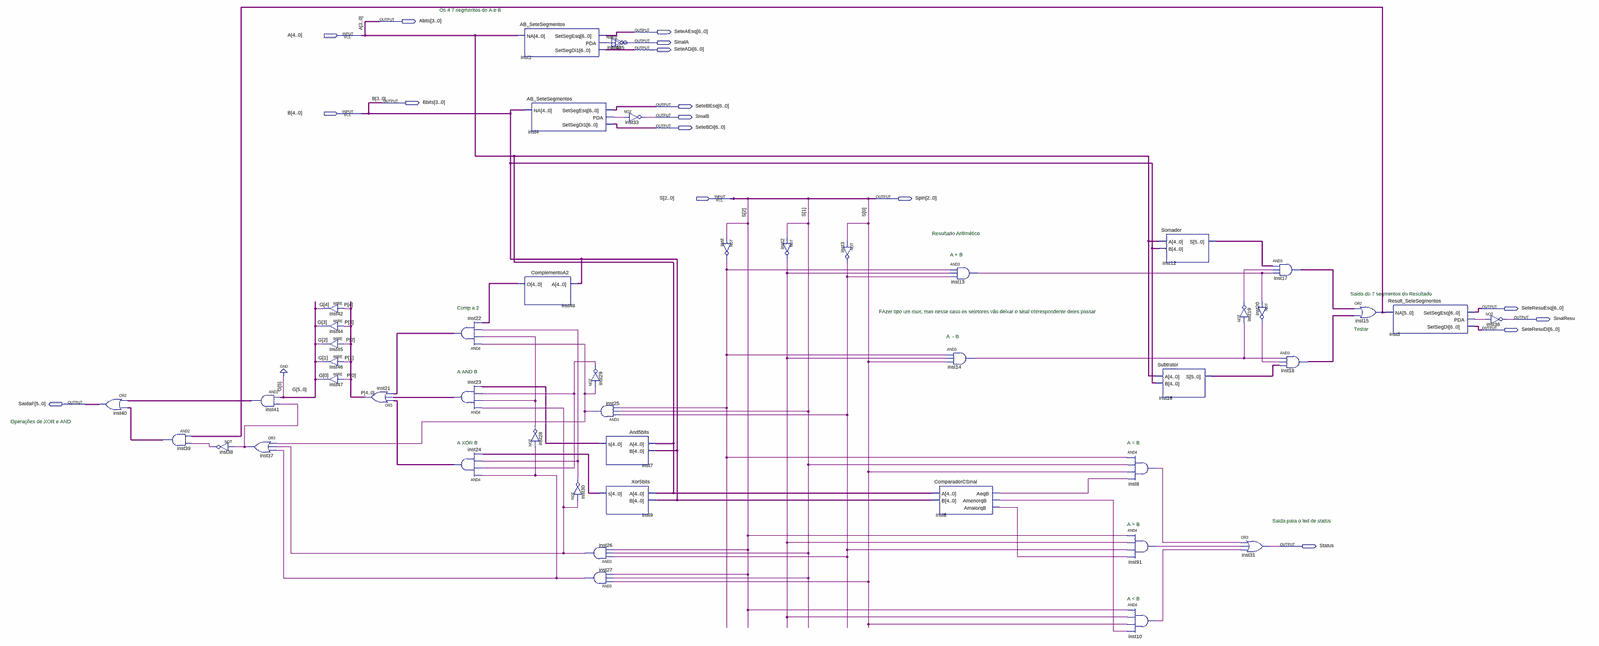
[diagram p0: schematic sheet, whole]
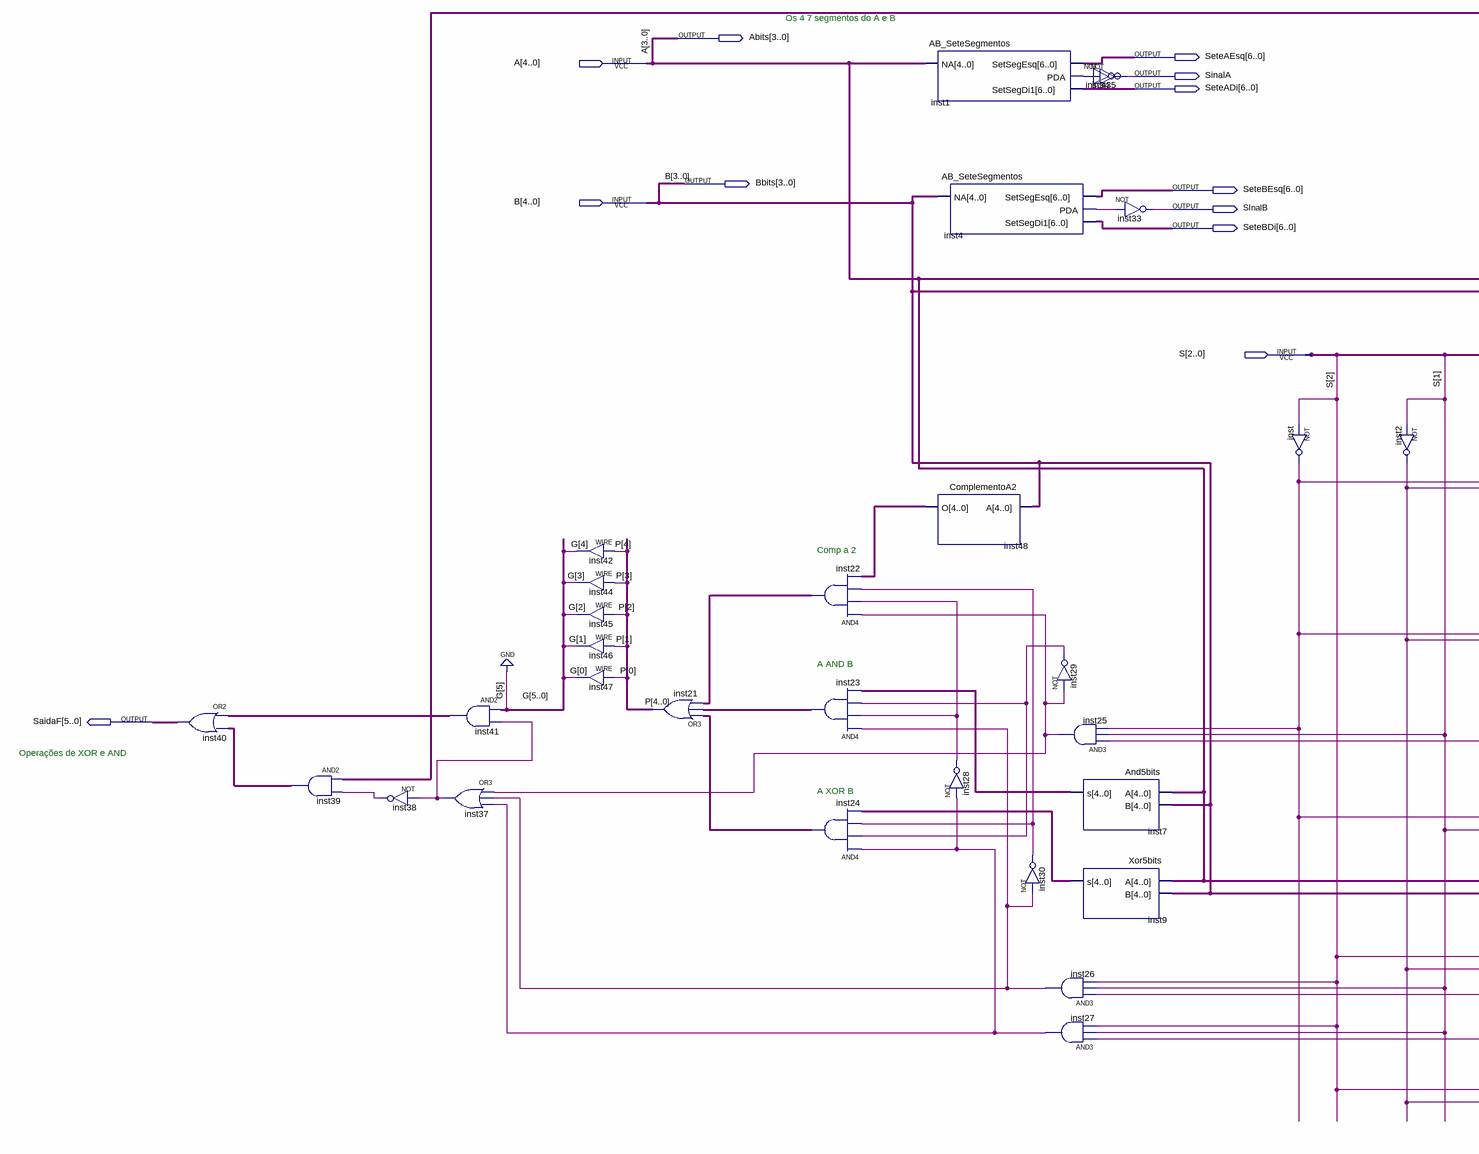
[diagram p1: schematic sheet, left part]
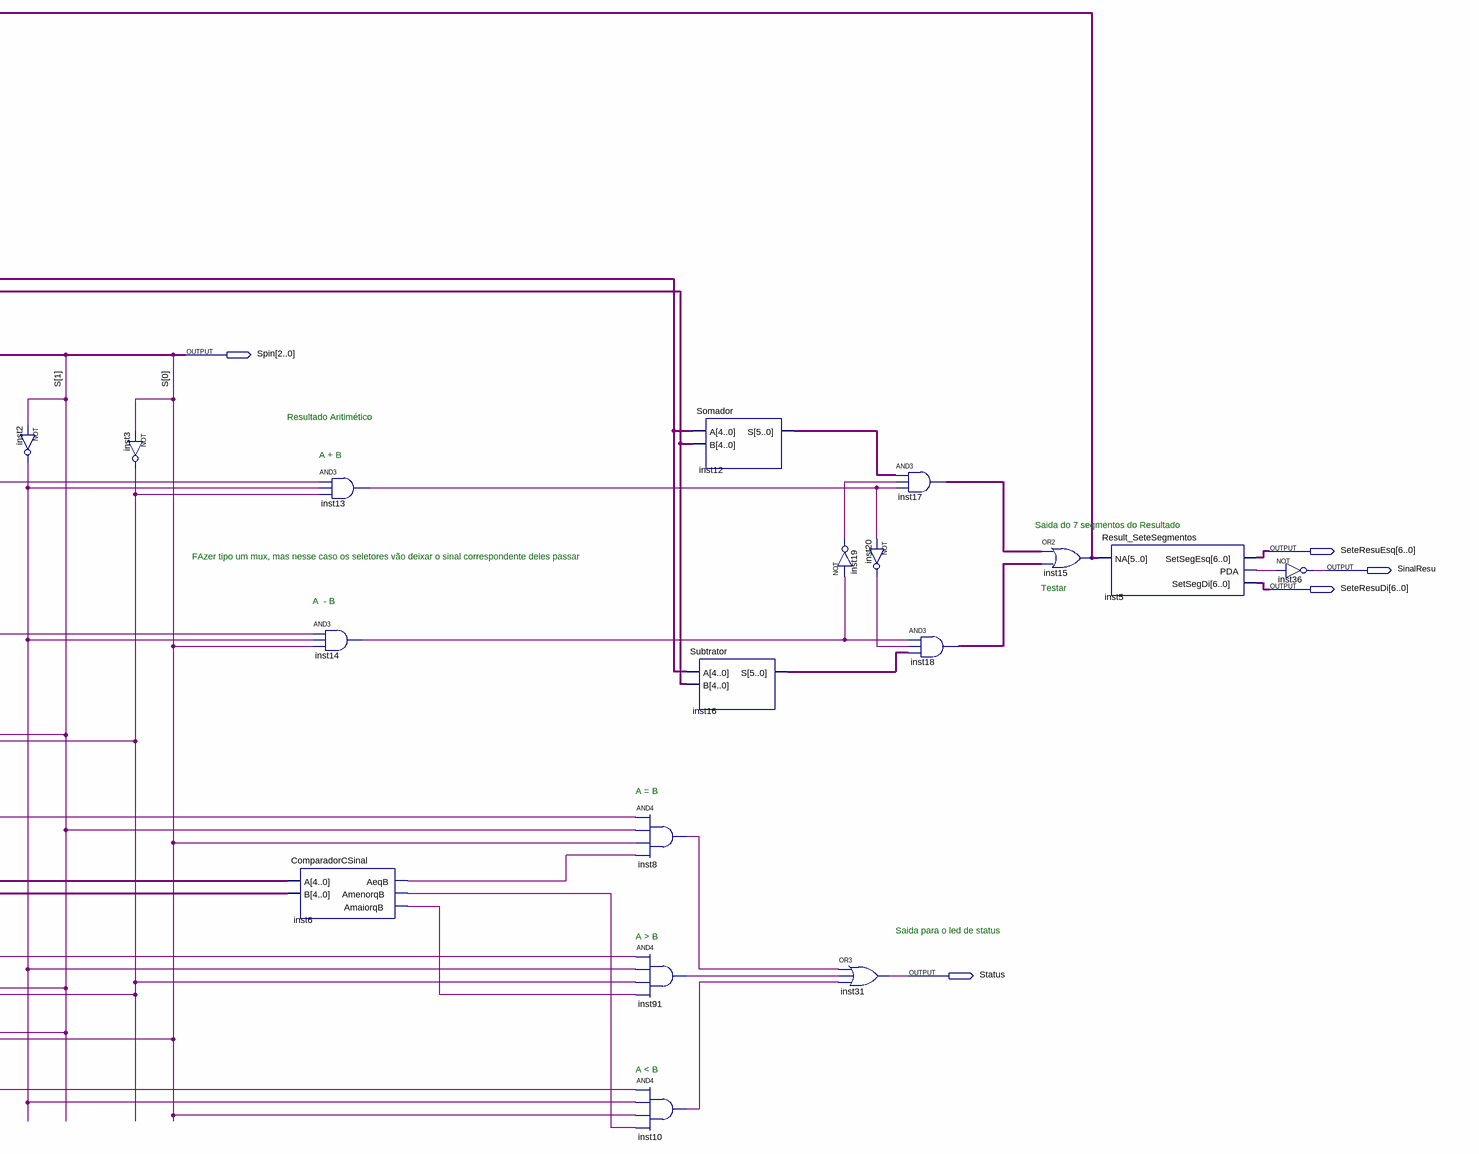
[diagram p2: schematic sheet, right part]
// Quartus schematic ULA_Principal.bdf as structural Verilog: 47 symbols, 17 pins
module ULA_Principal (
  input  [4:0] A,
  input  [4:0] B,
  input  [2:0] S,
  output [3:0] Abits,
  output [6:0] SeteAEsq,
  output SinalA,
  output [6:0] SeteADi,
  output [3:0] Bbits,
  output [6:0] SeteBEsq,
  output SInalB,
  output [6:0] SeteBDi,
  output [2:0] Spin,
  output [6:0] SeteResuEsq,
  output SinalResu,
  output [6:0] SeteResuDi,
  output [5:0] SaidaF,
  output Status
);

  wire inst1_pda, inst2_out, inst3_out, inst4_pda, inst5_pda, inst6_aeqb, inst6_amaiorqb, inst6_amenorqb,
       inst8_out, inst10_out, inst13_out, inst14_out, inst19_out, inst20_out, inst25_out, inst26_out,
       inst27_out, inst28_out, inst29_out, inst30_out, inst37_out, inst38_out, inst91_out, inst_out;
  wire [4:0] G, inst7_s, inst9_s, inst22_out, inst23_out, inst24_out, inst48_o, P;
  wire [5:0] inst12_s, inst15_out, inst16_s, inst17_out, inst18_out, inst39_out, inst41_out;

  assign SaidaF = inst41_out | inst39_out;  // OR2 inst40, 6 bits wide
  assign inst39_out = inst15_out & {6{inst38_out}};  // AND2 inst39, 6 bits wide
  not inst38 (inst38_out, inst37_out);
  assign inst41_out = {1'b0, G} & {6{inst37_out}};  // AND2 inst41, 6 bits wide
  or inst37 (inst37_out, inst25_out, inst26_out, inst27_out);
  assign G[4] = P[4];  // WIRE inst42
  assign G[3] = P[3];  // WIRE inst44
  assign G[2] = P[2];  // WIRE inst45
  assign G[1] = P[1];  // WIRE inst46
  assign G[0] = P[0];  // WIRE inst47
  assign P = inst24_out | inst23_out | inst22_out;  // OR3 inst21, 5 bits wide
  assign inst22_out = {5{inst25_out}} & {5{inst28_out}} & {5{inst30_out}} & inst48_o;  // AND4 inst22, 5 bits wide
  assign inst23_out = {5{inst26_out}} & {5{inst28_out}} & {5{inst29_out}} & inst7_s;  // AND4 inst23, 5 bits wide
  assign inst24_out = {5{inst27_out}} & {5{inst29_out}} & {5{inst30_out}} & inst9_s;  // AND4 inst24, 5 bits wide
  AB_SeteSegmentos inst1 (.NA(A), .SetSegEsq(SeteAEsq), .PDA(inst1_pda), .SetSegDi1(SeteADi));
  AB_SeteSegmentos inst4 (.NA(B), .SetSegEsq(SeteBEsq), .PDA(inst4_pda), .SetSegDi1(SeteBDi));
  ComplementoA2 inst48 (.A(B), .O(inst48_o));
  not inst28 (inst28_out, inst27_out);
  not inst30 (inst30_out, inst26_out);
  and inst26 (inst26_out, inst3_out, S[1], S[2]);
  and inst27 (inst27_out, S[0], S[1], S[2]);
  // NOT inst34 has open pins: IN=inst1_pda, OUT=open
  not inst35 (SinalA, inst1_pda);
  not inst29 (inst29_out, inst25_out);
  and inst25 (inst25_out, inst3_out, S[1], inst_out);
  And5bits inst7 (.A(A), .B(B), .s(inst7_s));
  Xor5bits inst9 (.A(A), .B(B), .s(inst9_s));
  not inst33 (SInalB, inst4_pda);
  not inst (inst_out, S[2]);
  not inst2 (inst2_out, S[1]);
  not inst3 (inst3_out, S[0]);
  and inst13 (inst13_out, inst_out, inst2_out, inst3_out);
  and inst14 (inst14_out, inst_out, inst2_out, S[0]);
  ComparadorCSinal inst6 (.A(A), .B(B), .AeqB(inst6_aeqb), .AmenorqB(inst6_amenorqb), .AmaiorqB(inst6_amaiorqb));
  and inst8 (inst8_out, inst_out, S[1], S[0], inst6_aeqb);
  and inst91 (inst91_out, S[2], inst2_out, inst3_out, inst6_amaiorqb);
  and inst10 (inst10_out, S[2], inst2_out, S[0], inst6_amenorqb);
  Somador inst12 (.A(A), .B(B), .S(inst12_s));
  Subtrator inst16 (.A(A), .B(B), .S(inst16_s));
  not inst19 (inst19_out, inst14_out);
  not inst20 (inst20_out, inst13_out);
  or inst31 (Status, inst8_out, inst91_out, inst10_out);
  assign inst17_out = inst12_s & {6{inst19_out}} & {6{inst13_out}};  // AND3 inst17, 6 bits wide
  assign inst18_out = {6{inst14_out}} & {6{inst20_out}} & inst16_s;  // AND3 inst18, 6 bits wide
  assign inst15_out = inst17_out | inst18_out;  // OR2 inst15, 6 bits wide
  Result_SeteSegmentos inst5 (.NA(inst15_out), .SetSegEsq(SeteResuEsq), .PDA(inst5_pda), .SetSegDi(SeteResuDi));
  not inst36 (SinalResu, inst5_pda);

  assign Abits = A[3:0];
  assign Bbits = B[3:0];
  assign Spin = S;

  // Notes on the sheet:
  //   Os 4 7 segmentos do A e B
  //   Resultado Aritimético
  //   A + B
  //   Saida do 7 segmentos do Resultado
  //   Comp a 2
  //   FAzer tipo um mux, mas nesse caso os seletores vão deixar o sinal correspondente deles passar
  //   Testar
  //   A  - B
  //   A AND B
  //   Operações de XOR e AND
  //   A XOR B
  //   A = B
  //   Saida para o led de status
  //   A > B
  //   A < B
endmodule
